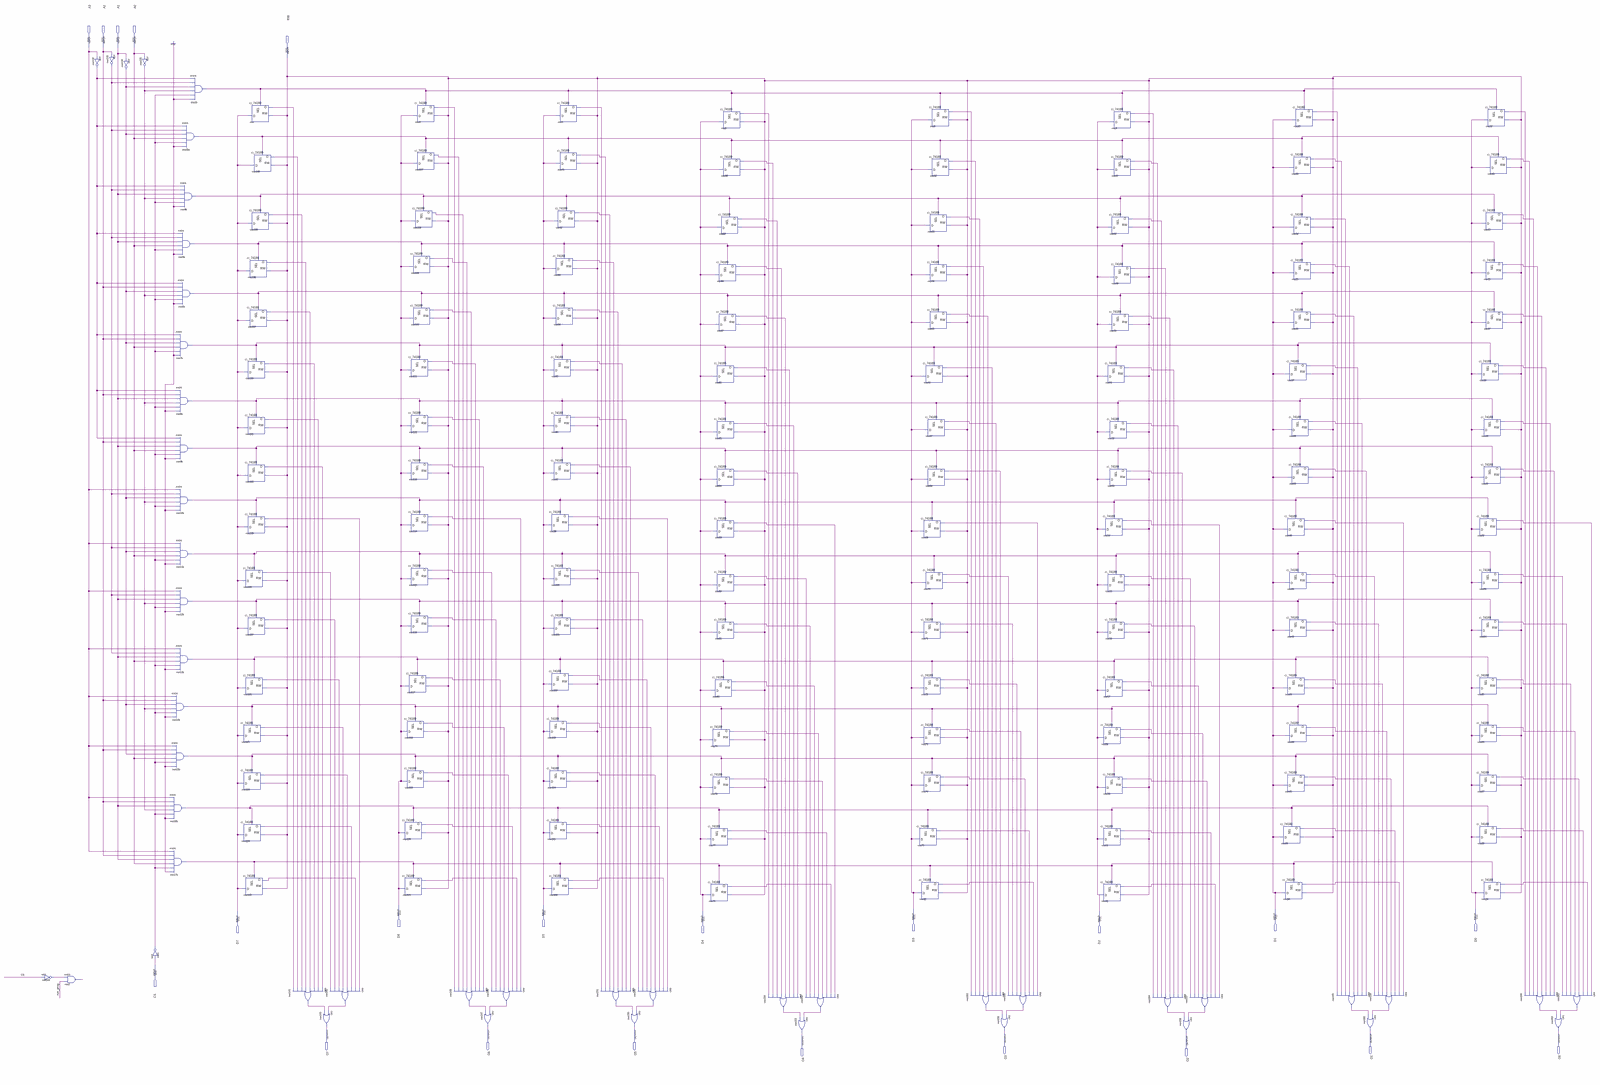
[diagram p0: schematic sheet, whole]
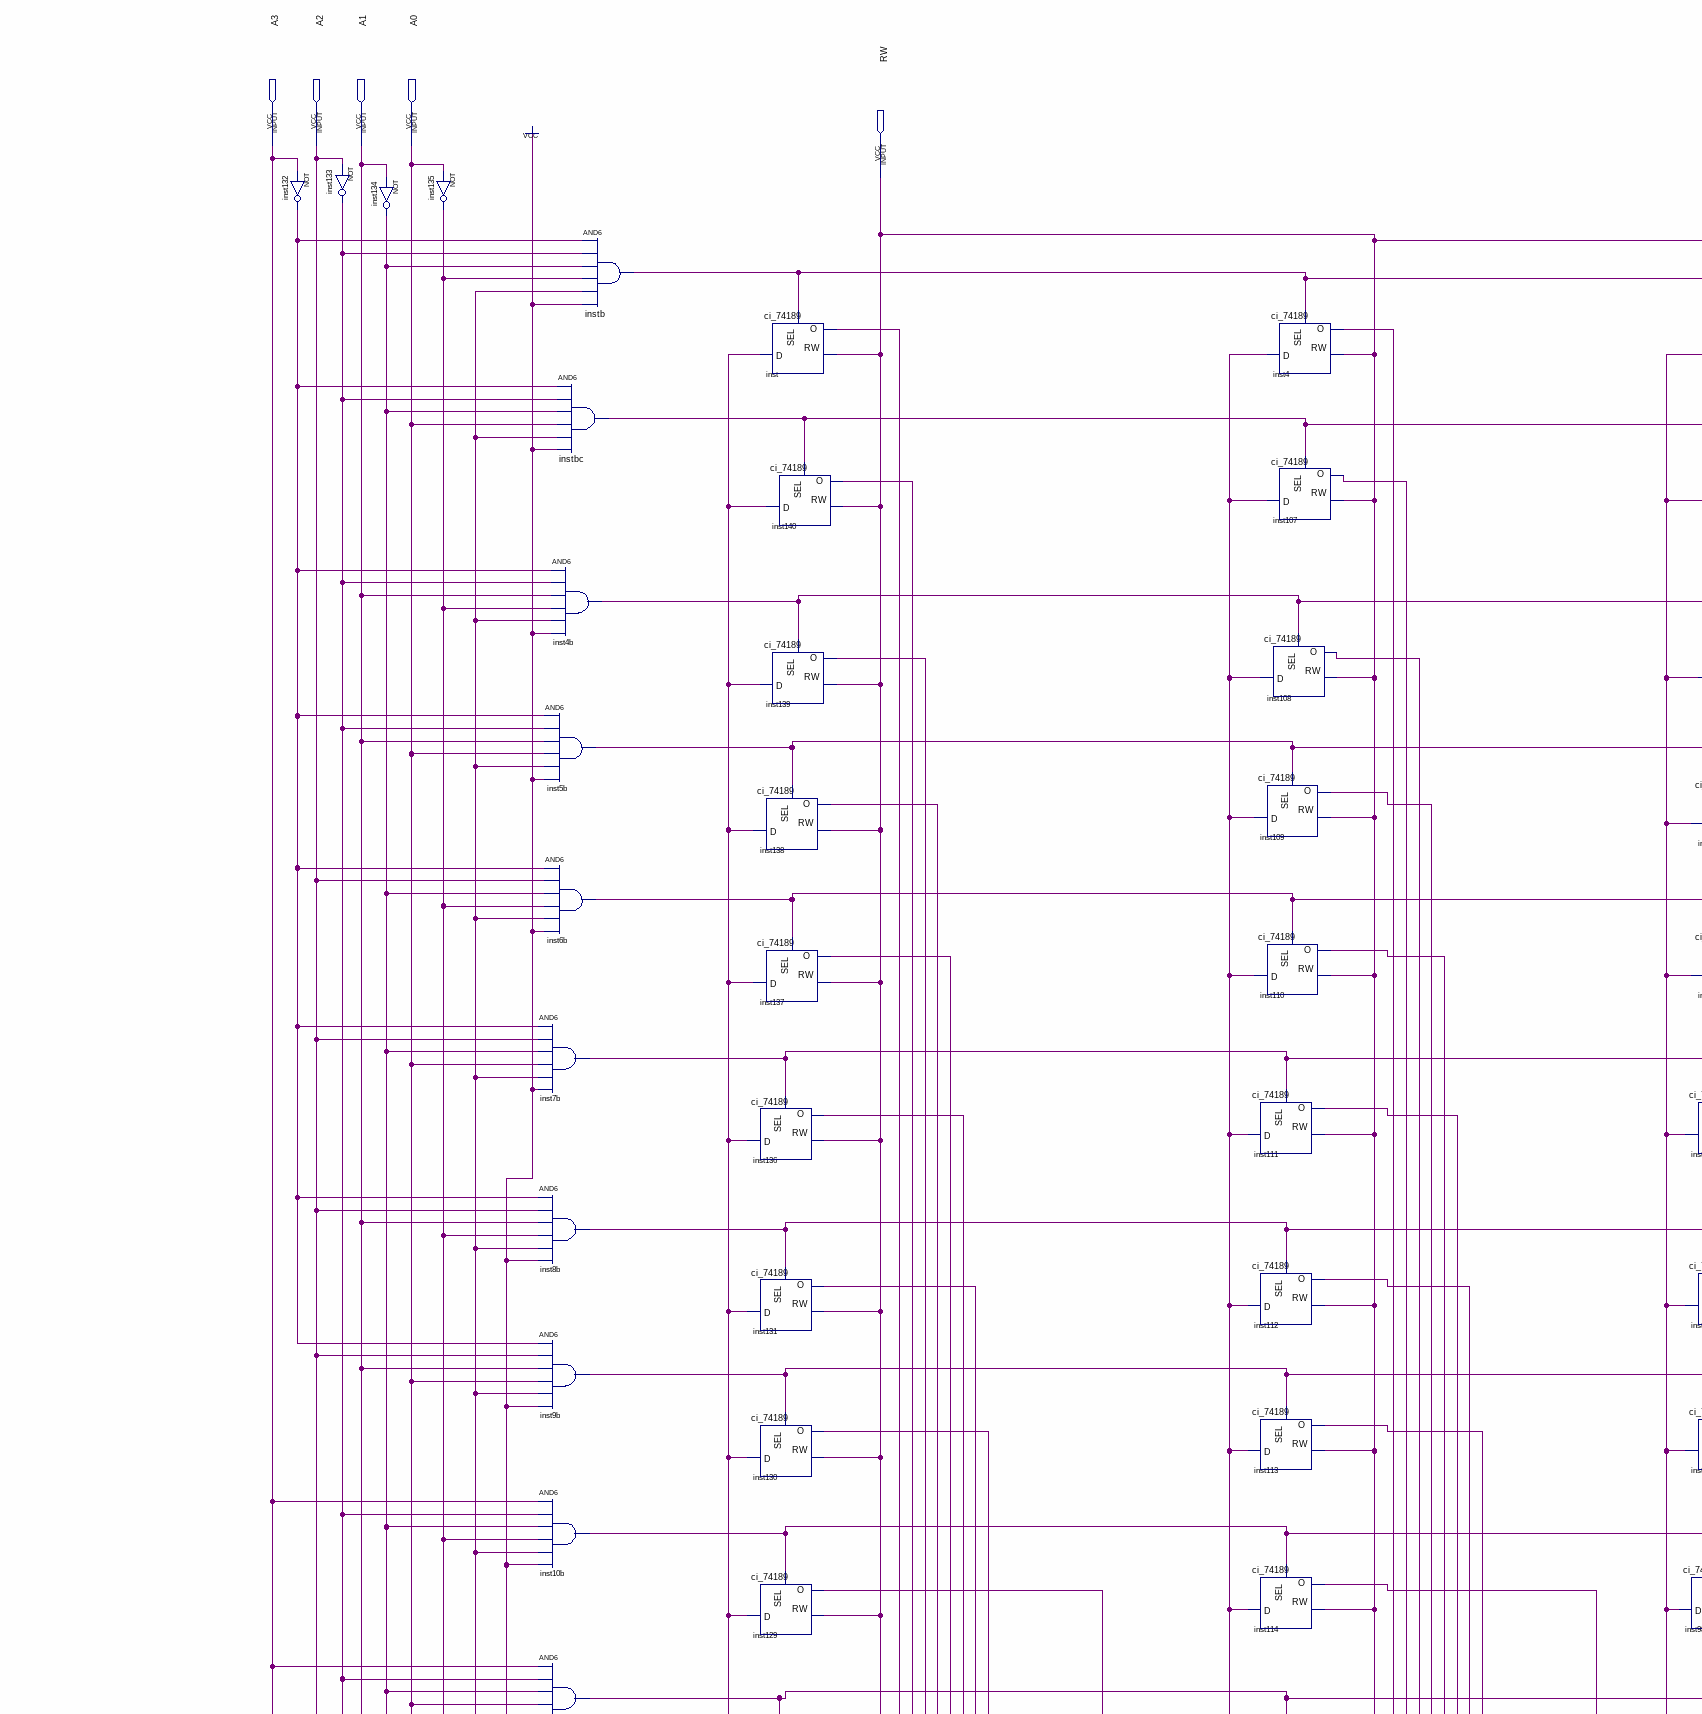
[diagram p1: schematic sheet, upper left part]
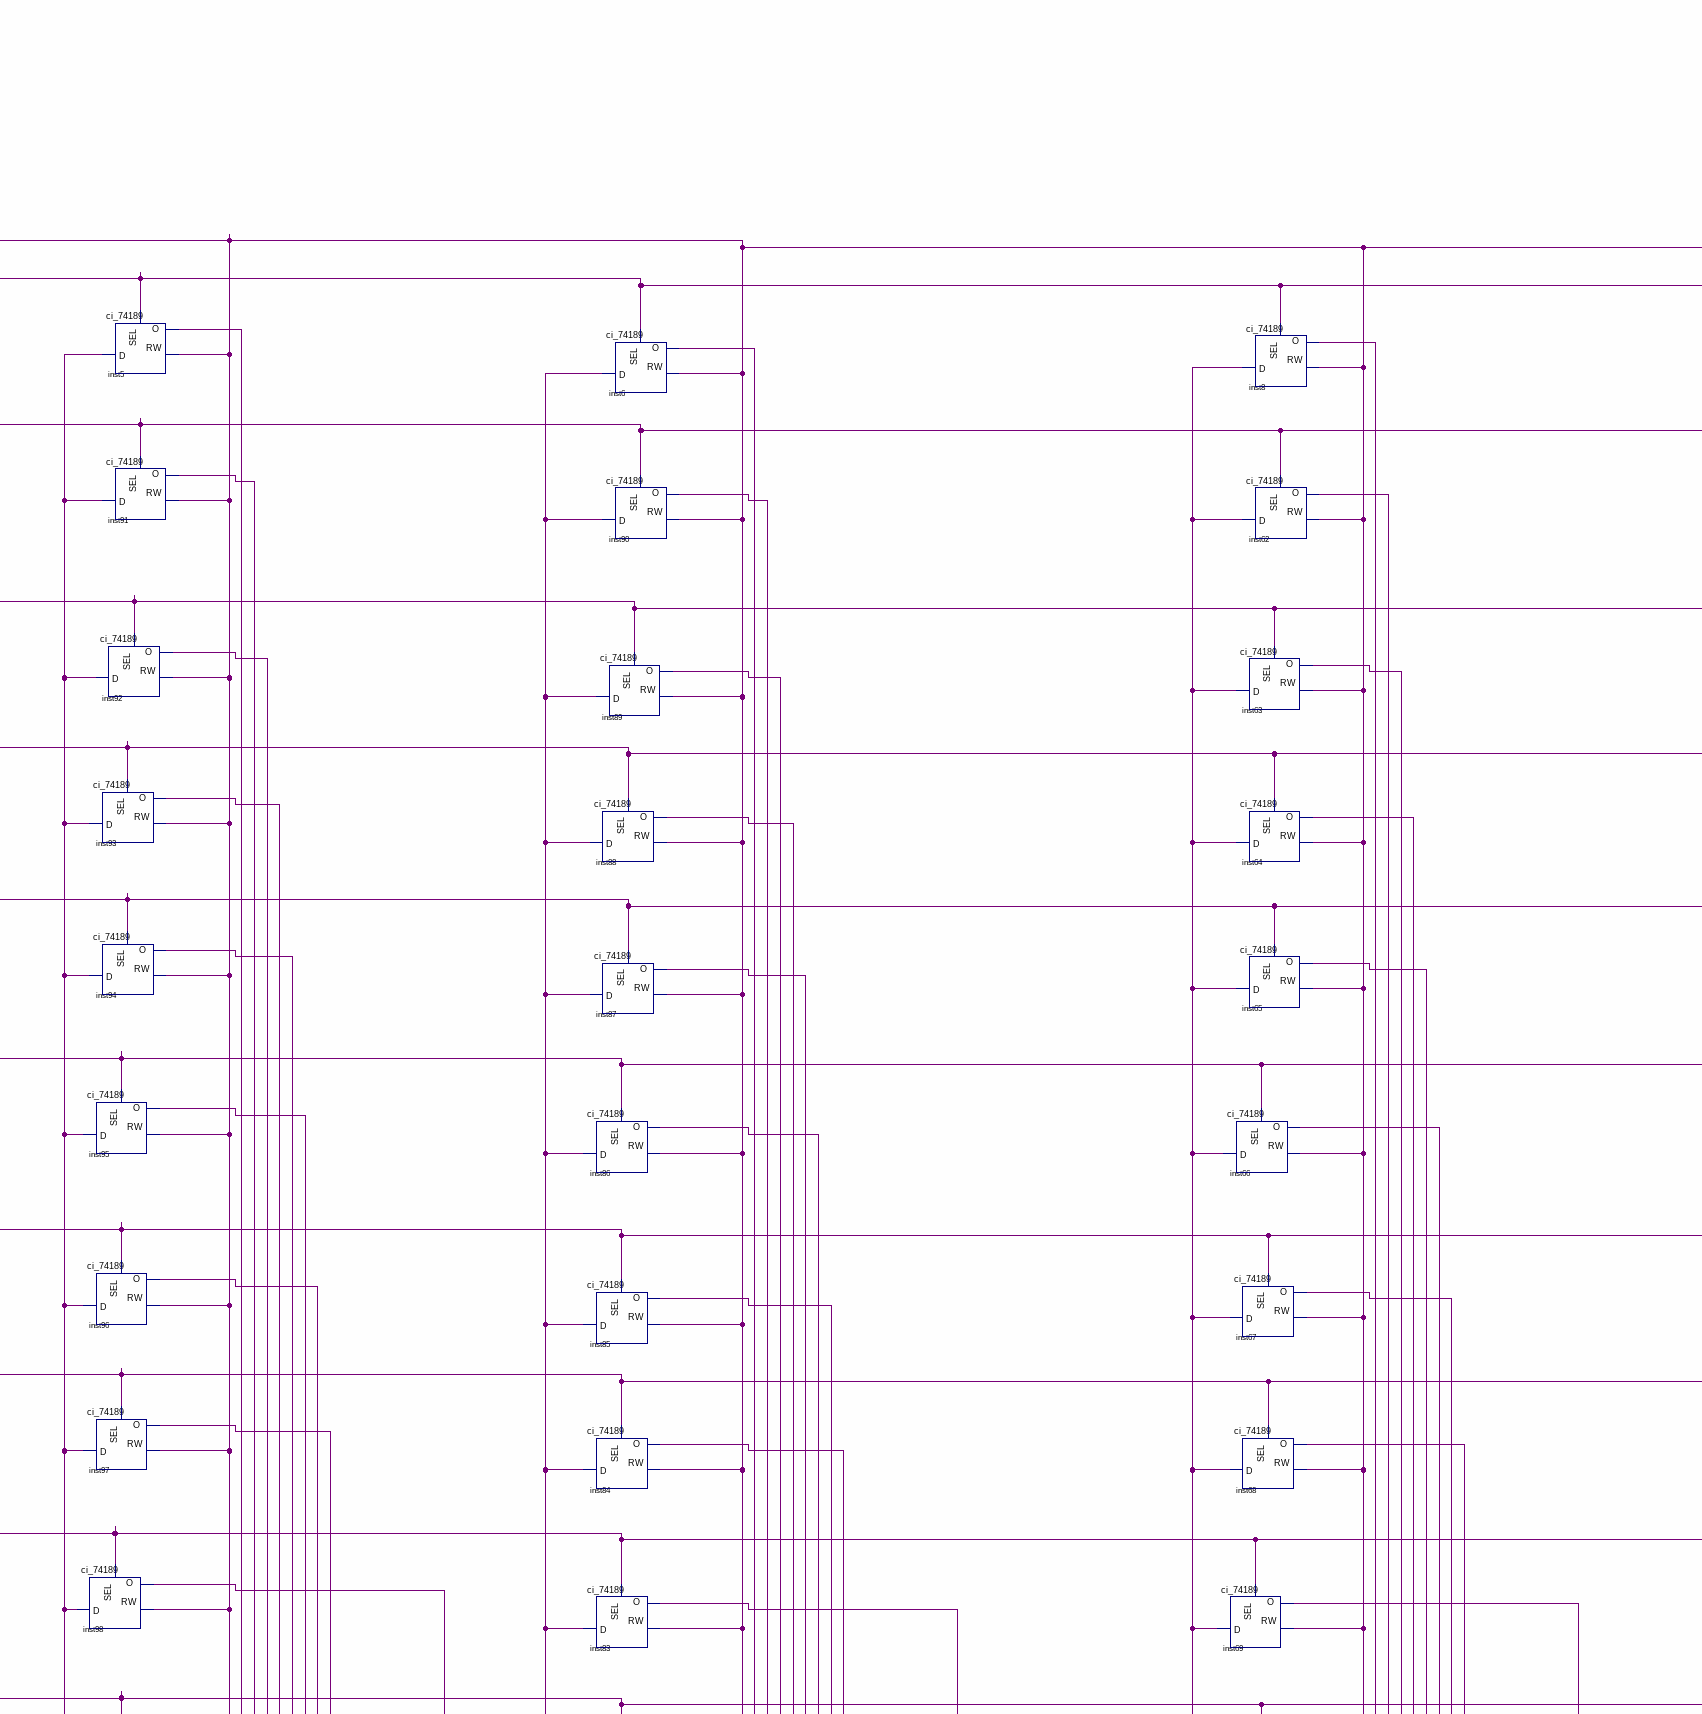
[diagram p2: schematic sheet, upper centre part]
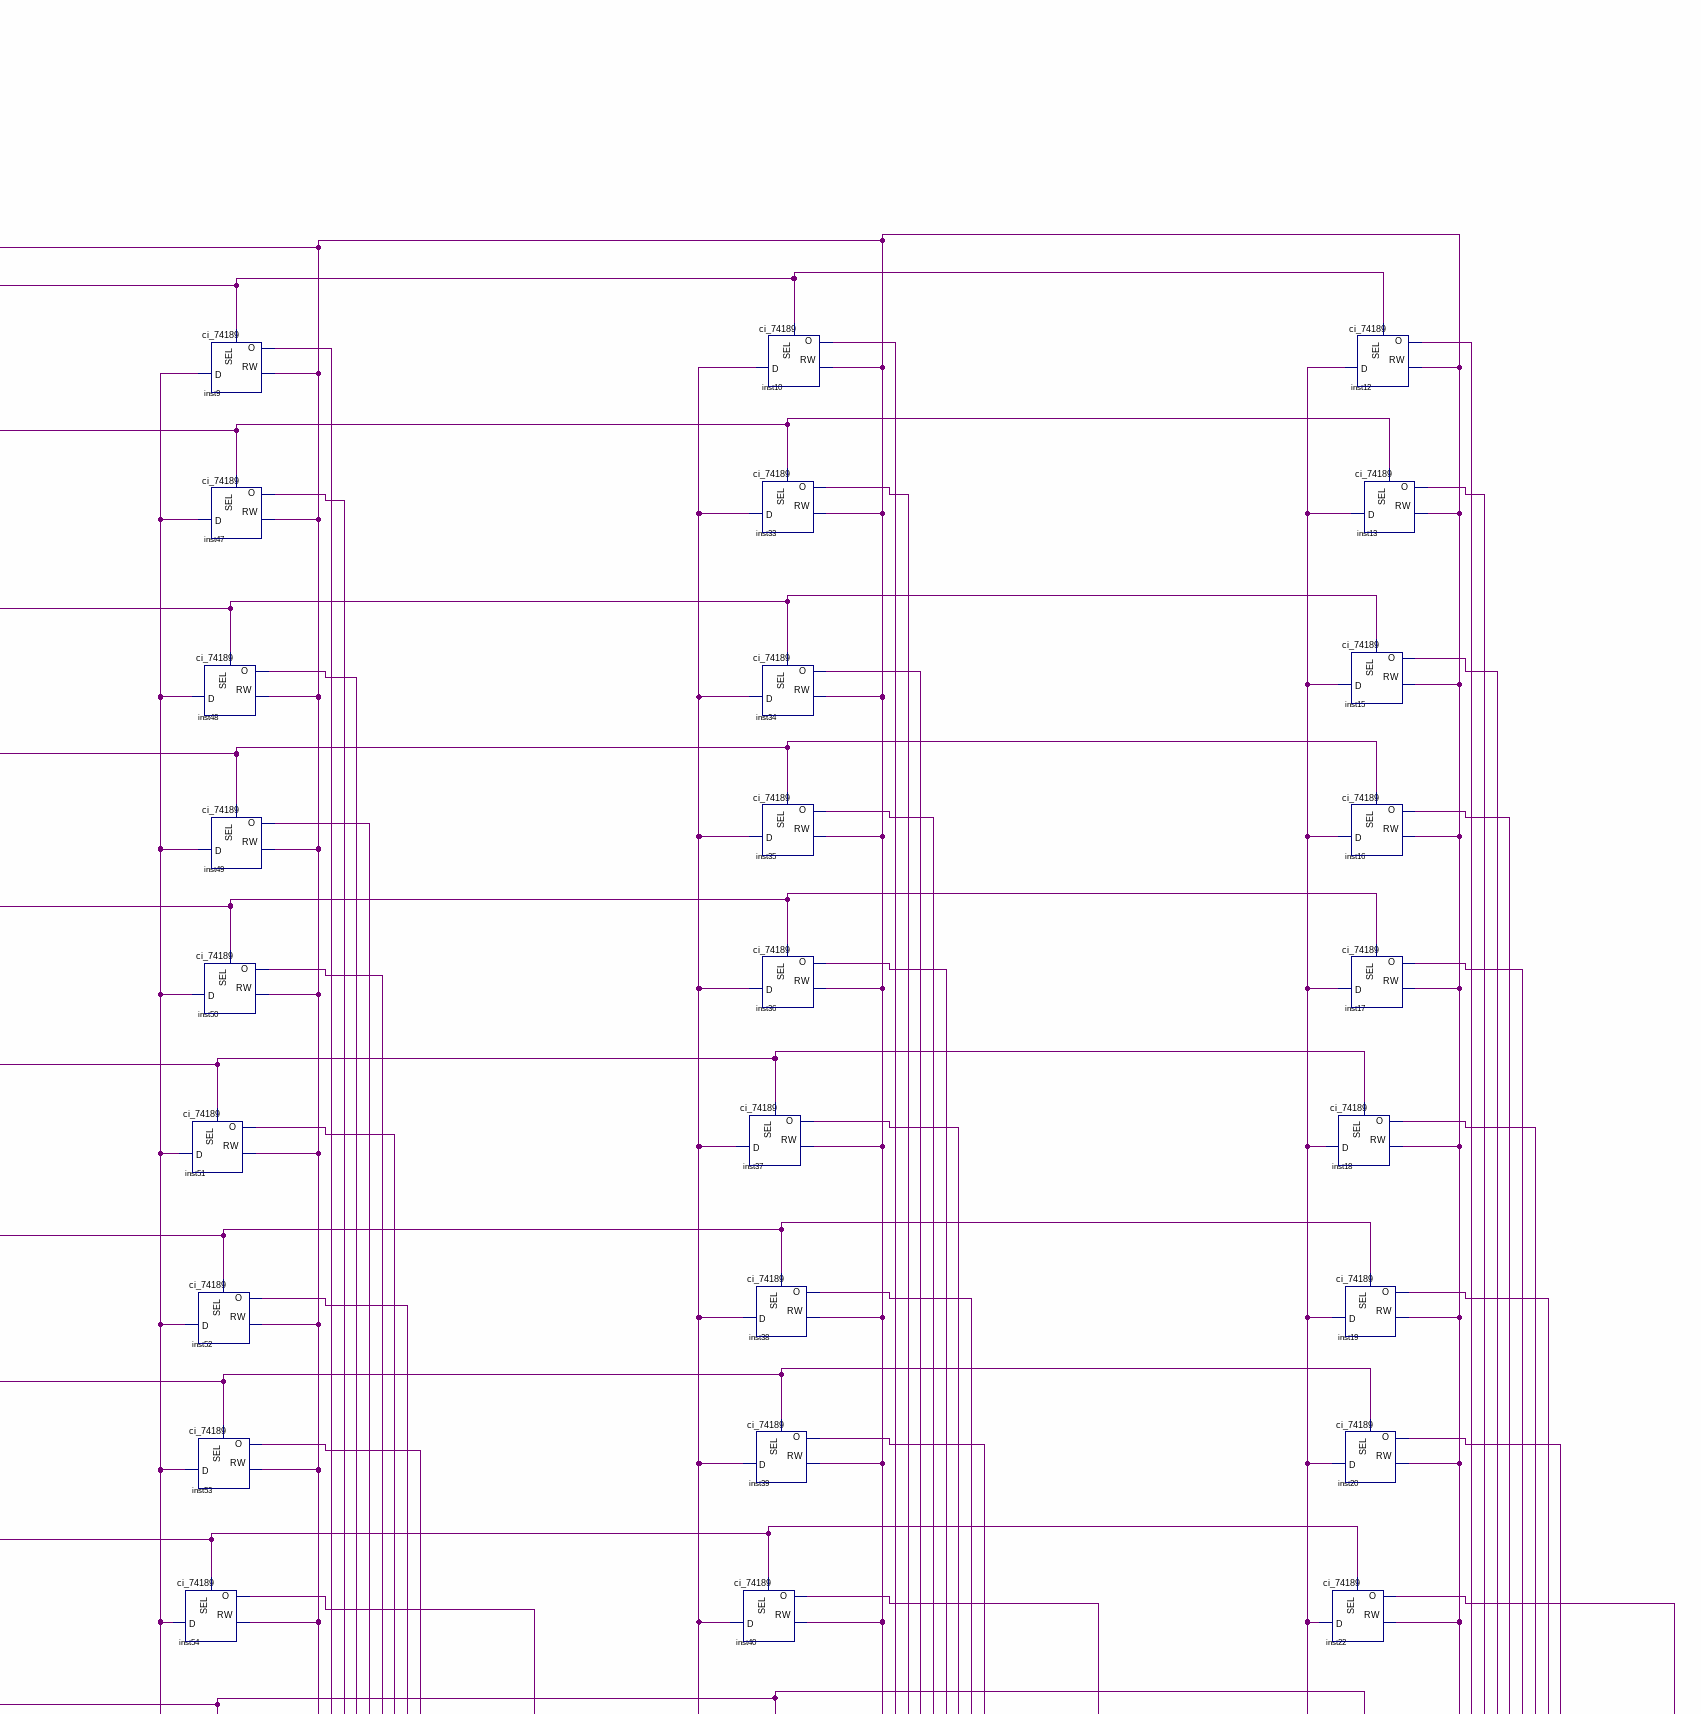
[diagram p3: schematic sheet, upper right part]
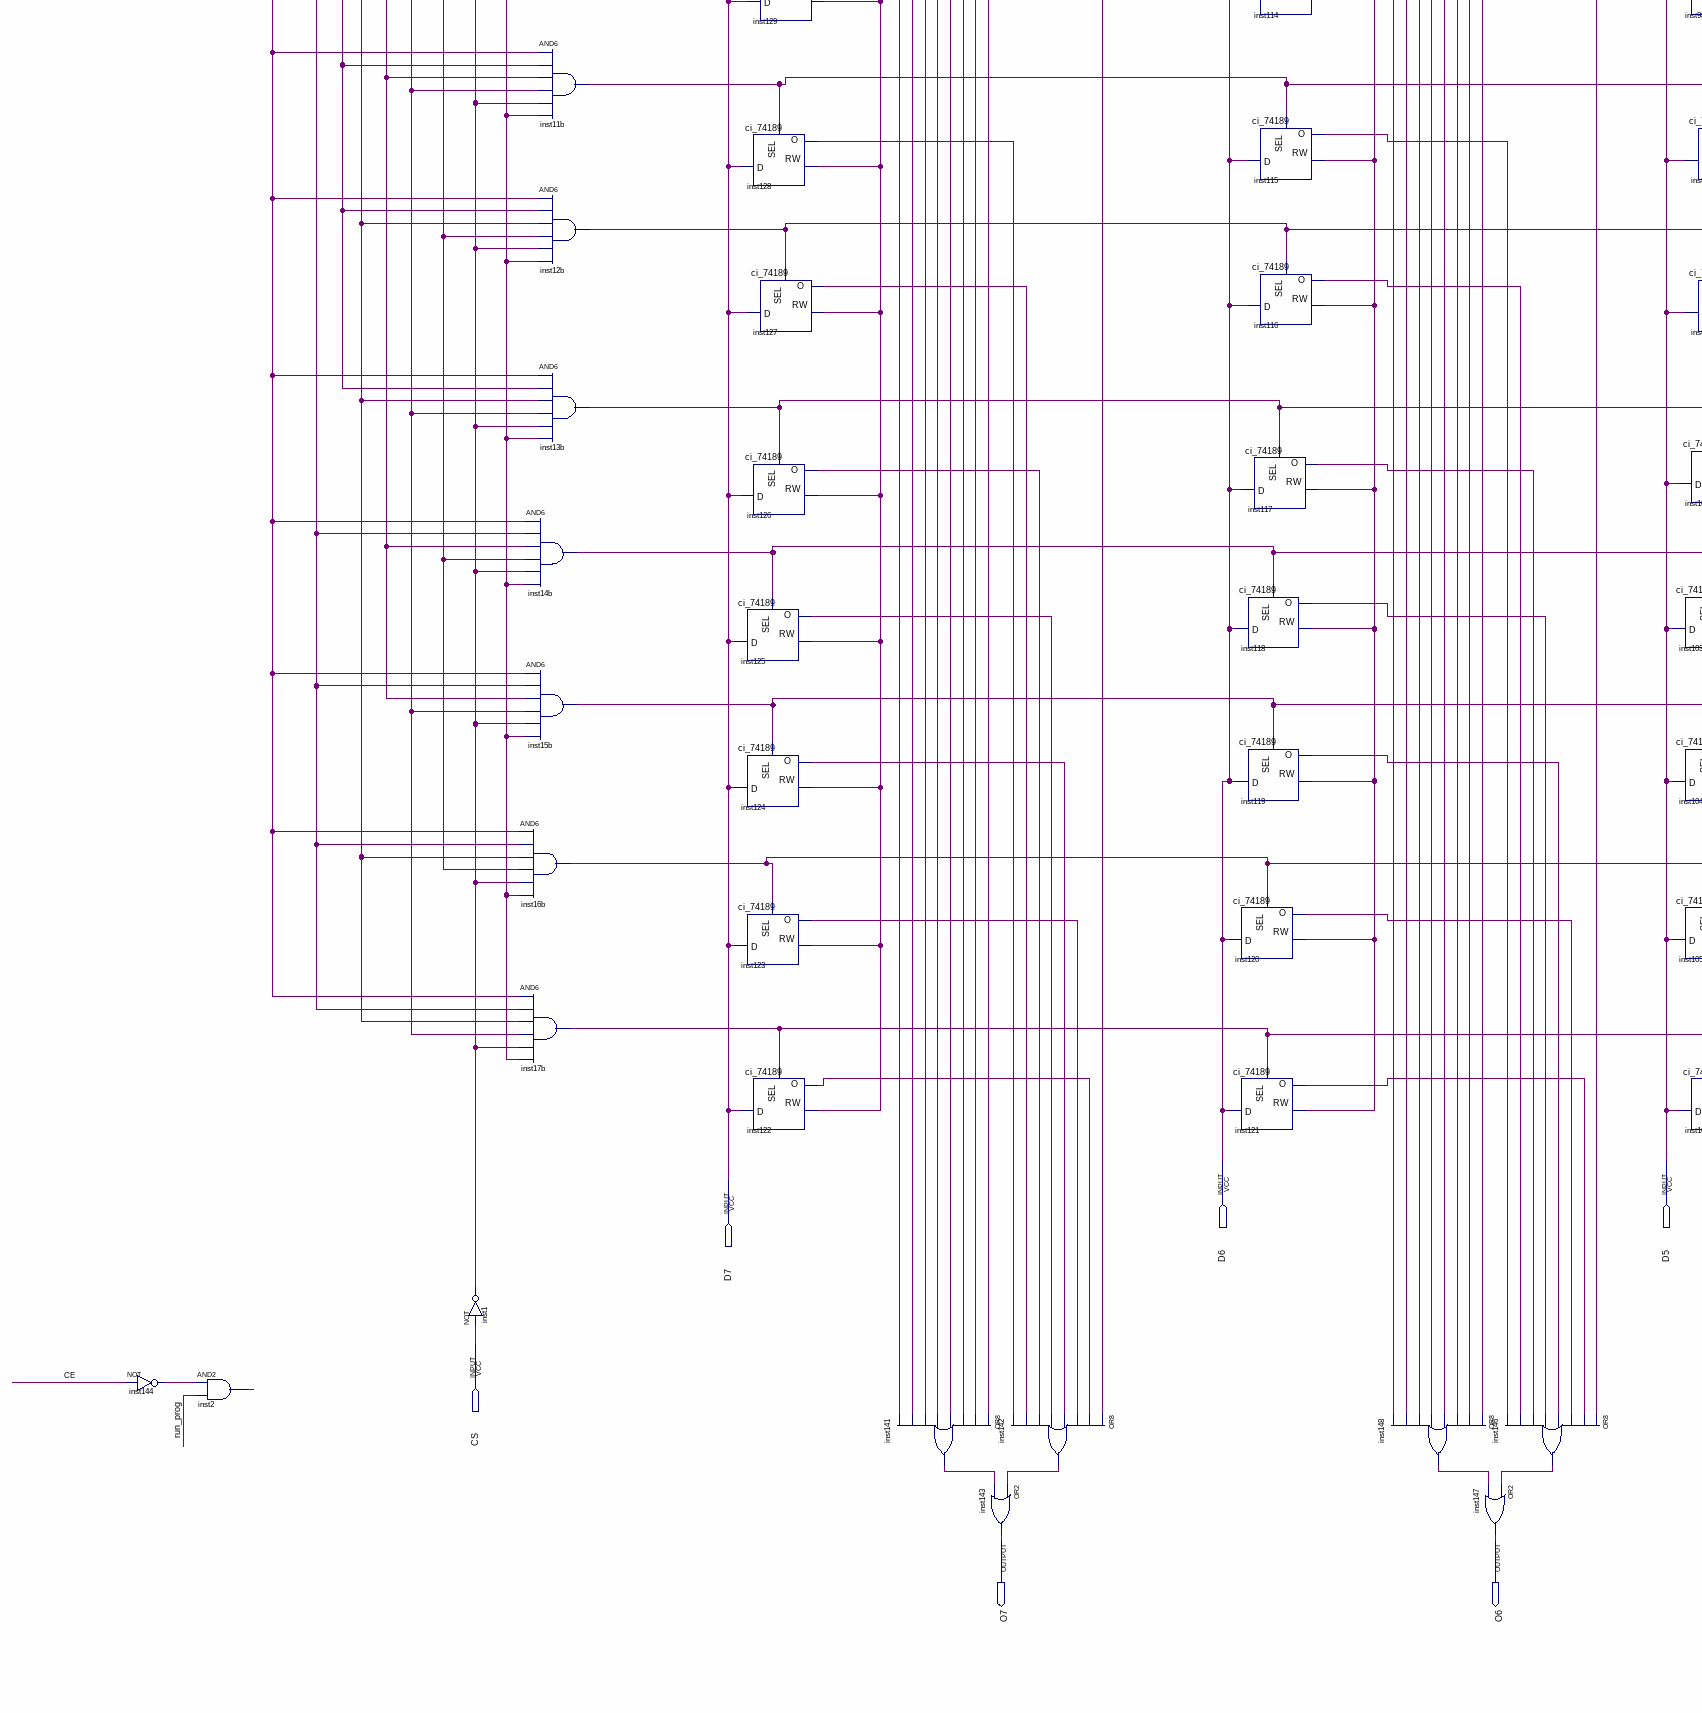
[diagram p4: schematic sheet, lower left part]
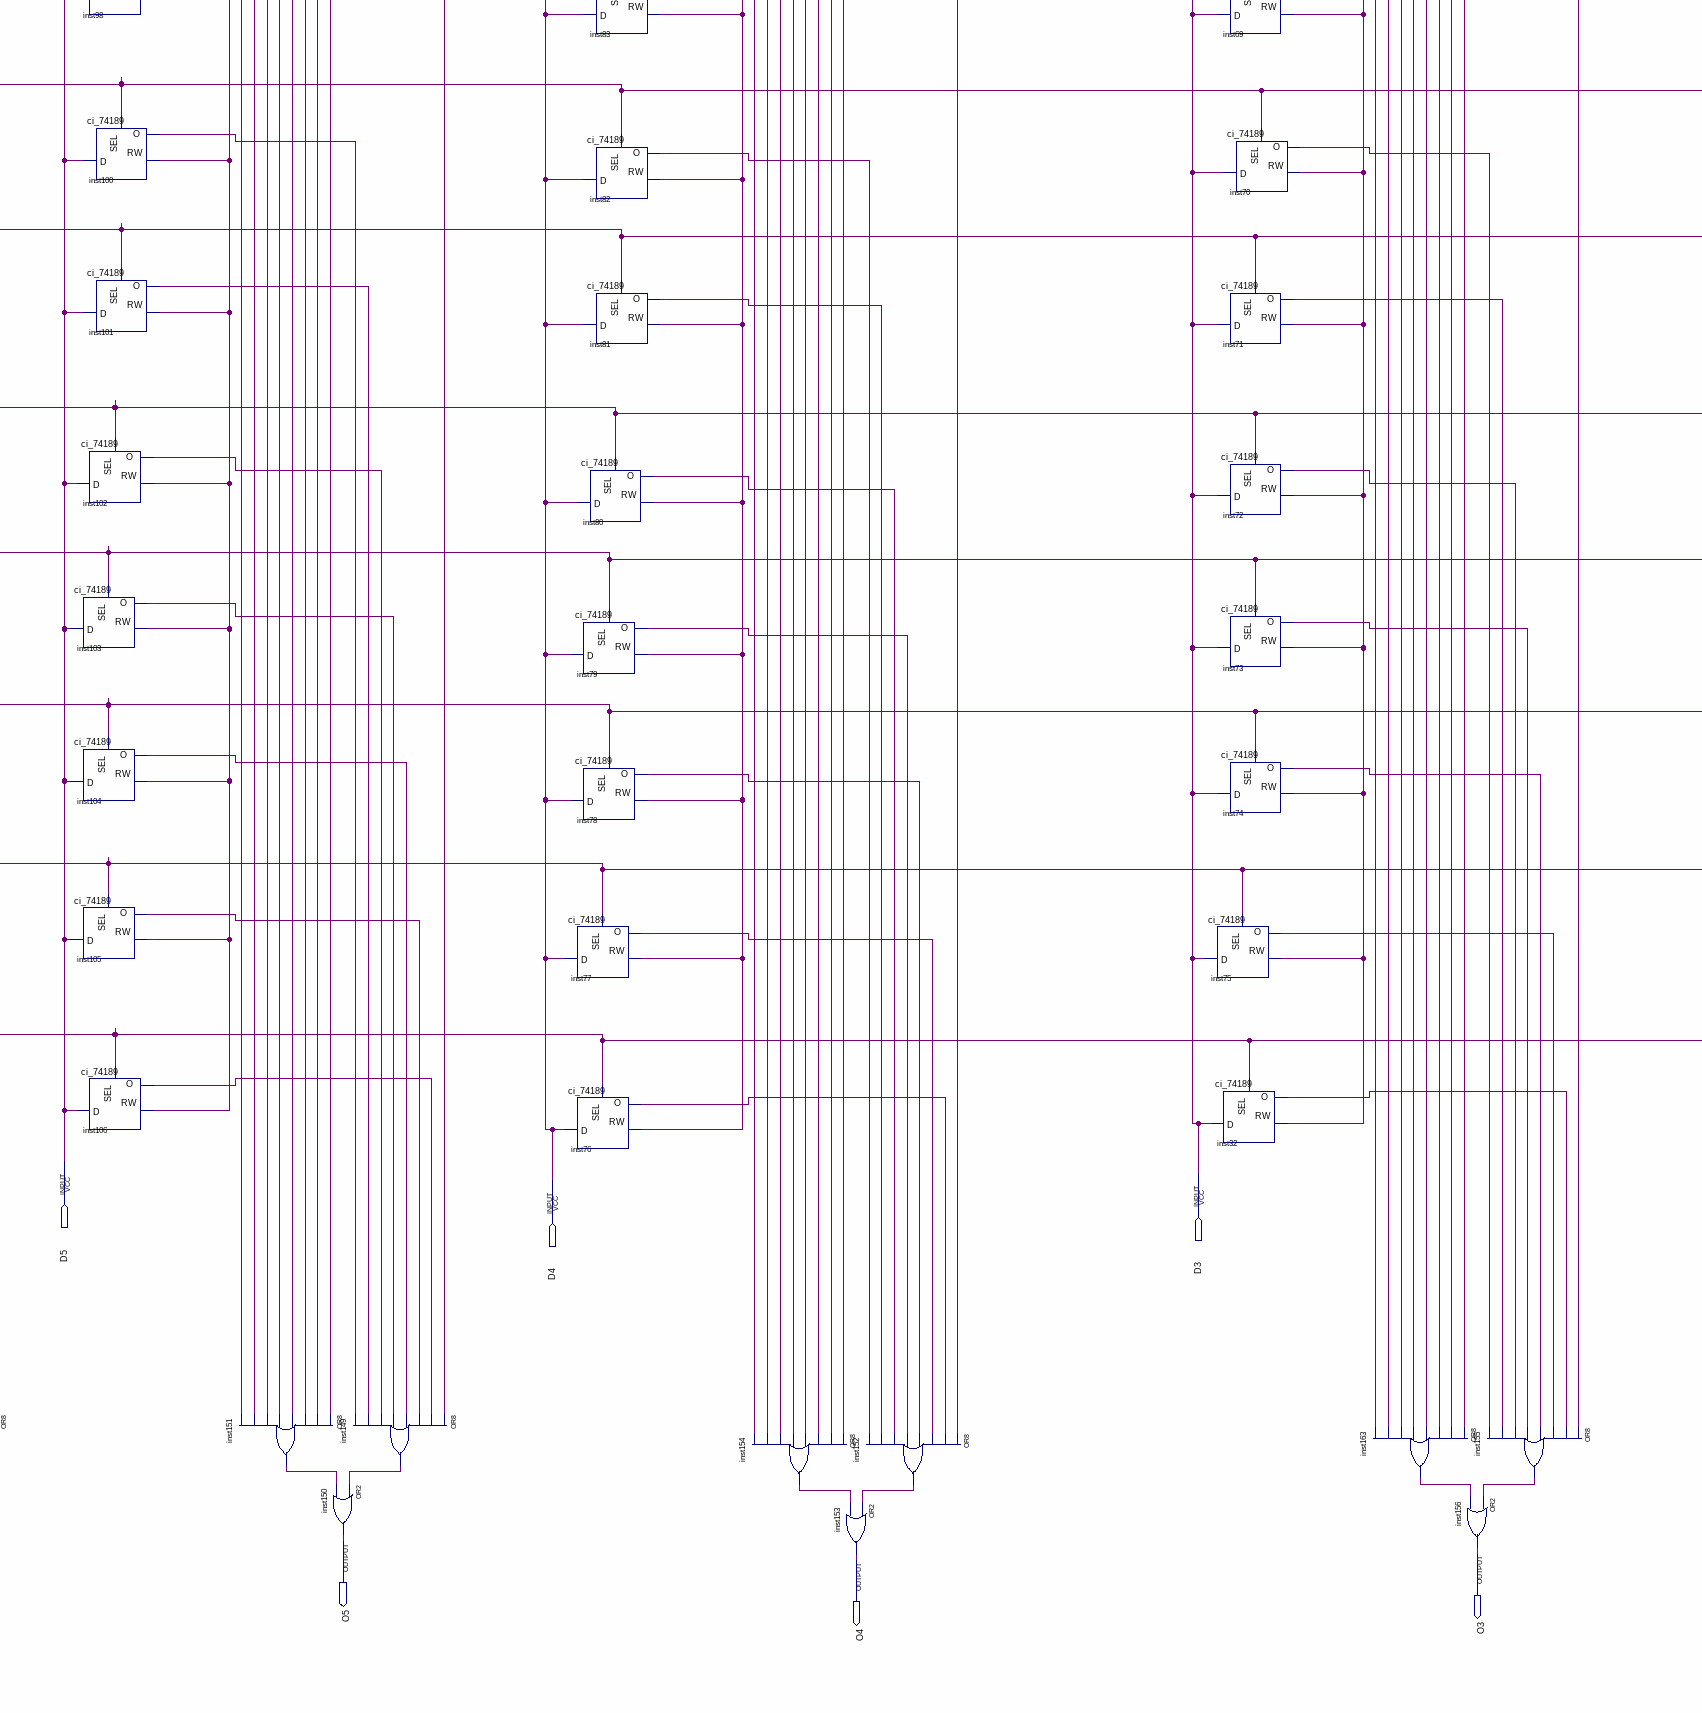
[diagram p5: schematic sheet, lower centre part]
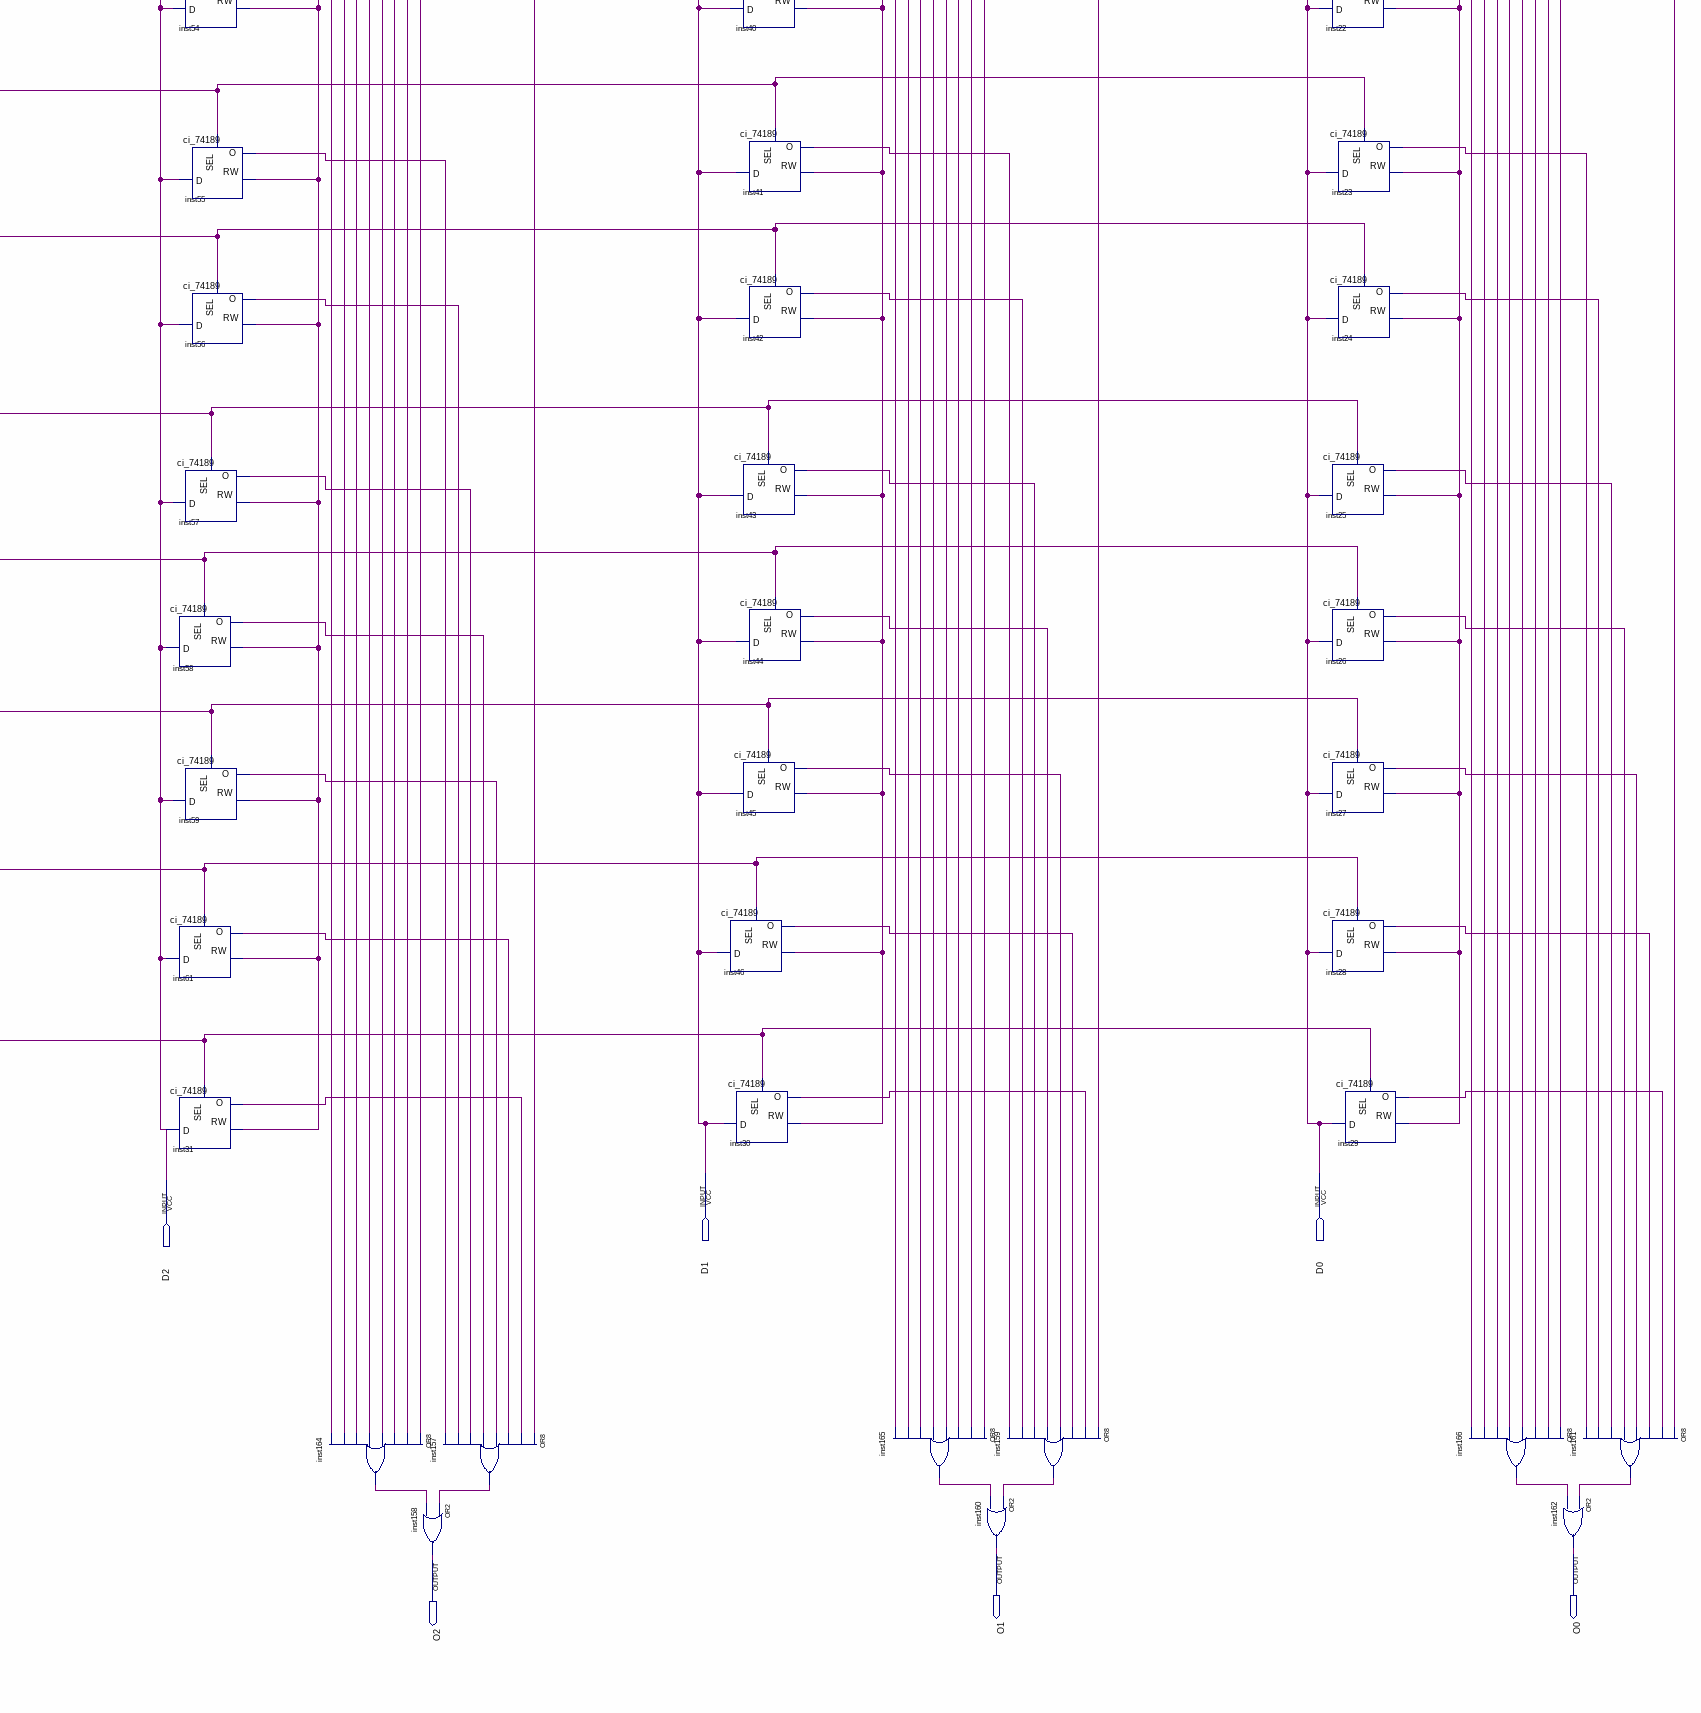
[diagram p6: schematic sheet, lower right part]
// Quartus schematic ram16x8.bdf as structural Verilog: 175 symbols, 22 pins
module ram16x8 (
  input  A3,
  input  A2,
  input  A1,
  input  A0,
  input  RW,
  input  D6,
  input  D5,
  input  D3,
  input  D1,
  input  D0,
  input  D7,
  input  D4,
  input  D2,
  input  CS,
  output O7,
  output O6,
  output O5,
  output O3,
  output O1,
  output O0,
  output O4,
  output O2
);

  wire CE, inst1_out, inst2_out, inst4_o, inst4b_out, inst5_o, inst5b_out, inst6_o, inst6b_out, inst7b_out,
       inst8_o, inst8b_out, inst9_o, inst9b_out, inst10_o, inst10b_out, inst11b_out, inst12_o, inst12b_out,
       inst13_o, inst13b_out, inst14b_out, inst15_o, inst15b_out, inst16_o, inst16b_out, inst17_o,
       inst17b_out, inst18_o, inst19_o, inst20_o, inst22_o, inst23_o, inst24_o, inst25_o, inst26_o, inst27_o,
       inst28_o, inst29_o, inst30_o, inst31_o, inst32_o, inst33_o, inst34_o, inst35_o, inst36_o, inst37_o,
       inst38_o, inst39_o, inst40_o, inst41_o, inst42_o, inst43_o, inst44_o, inst45_o, inst46_o, inst47_o,
       inst48_o, inst49_o, inst50_o, inst51_o, inst52_o, inst53_o, inst54_o, inst55_o, inst56_o, inst57_o,
       inst58_o, inst59_o, inst61_o, inst62_o, inst63_o, inst64_o, inst65_o, inst66_o, inst67_o, inst68_o,
       inst69_o, inst70_o, inst71_o, inst72_o, inst73_o, inst74_o, inst75_o, inst76_o, inst77_o, inst78_o,
       inst79_o, inst80_o, inst81_o, inst82_o, inst83_o, inst84_o, inst85_o, inst86_o, inst87_o, inst88_o,
       inst89_o, inst90_o, inst91_o, inst92_o, inst93_o, inst94_o, inst95_o, inst96_o, inst97_o, inst98_o,
       inst100_o, inst101_o, inst102_o, inst103_o, inst104_o, inst105_o, inst106_o, inst107_o, inst108_o,
       inst109_o, inst110_o, inst111_o, inst112_o, inst113_o, inst114_o, inst115_o, inst116_o, inst117_o,
       inst118_o, inst119_o, inst120_o, inst121_o, inst122_o, inst123_o, inst124_o, inst125_o, inst126_o,
       inst127_o, inst128_o, inst129_o, inst130_o, inst131_o, inst132_out, inst133_out, inst134_out,
       inst135_out, inst136_o, inst137_o, inst138_o, inst139_o, inst140_o, inst141_out, inst142_out,
       inst144_out, inst146_out, inst148_out, inst149_out, inst151_out, inst152_out, inst154_out,
       inst155_out, inst157_out, inst159_out, inst161_out, inst163_out, inst164_out, inst165_out,
       inst166_out, inst_o, instb_out, instbc_out, run_prog;

  not inst144 (inst144_out, CE);
  and inst2 (inst2_out, inst144_out, run_prog);
  not inst132 (inst132_out, A3);
  not inst133 (inst133_out, A2);
  not inst134 (inst134_out, A1);
  not inst135 (inst135_out, A0);
  not inst1 (inst1_out, CS);
  and inst14b (inst14b_out, A3, A2, inst134_out, inst135_out, inst1_out, 1'b1);
  and inst15b (inst15b_out, A3, A2, inst134_out, A0, inst1_out, 1'b1);
  and inst16b (inst16b_out, A3, A2, A1, inst135_out, inst1_out, 1'b1);
  and inst17b (inst17b_out, A3, A2, A1, A0, inst1_out, 1'b1);
  and instbc (instbc_out, inst132_out, inst133_out, inst134_out, A0, inst1_out, 1'b1);
  and inst4b (inst4b_out, inst132_out, inst133_out, A1, inst135_out, inst1_out, 1'b1);
  and inst5b (inst5b_out, inst132_out, inst133_out, A1, A0, inst1_out, 1'b1);
  and inst6b (inst6b_out, inst132_out, A2, inst134_out, inst135_out, inst1_out, 1'b1);
  and inst7b (inst7b_out, inst132_out, A2, inst134_out, A0, inst1_out, 1'b1);
  and inst8b (inst8b_out, inst132_out, A2, A1, inst135_out, inst1_out, 1'b1);
  and inst9b (inst9b_out, inst132_out, A2, A1, A0, inst1_out, 1'b1);
  and inst10b (inst10b_out, A3, inst133_out, inst134_out, inst135_out, inst1_out, 1'b1);
  and inst11b (inst11b_out, A3, inst133_out, inst134_out, A0, inst1_out, 1'b1);
  and inst12b (inst12b_out, A3, inst133_out, A1, inst135_out, inst1_out, 1'b1);
  and inst13b (inst13b_out, A3, inst133_out, A1, A0, inst1_out, 1'b1);
  and instb (instb_out, inst132_out, inst133_out, inst134_out, inst135_out, inst1_out, 1'b1);
  ci_74189 inst (.SEL(instb_out), .D(D7), .RW(RW), .O(inst_o));
  ci_74189 inst140 (.SEL(instbc_out), .D(D7), .RW(RW), .O(inst140_o));
  ci_74189 inst139 (.SEL(inst4b_out), .D(D7), .RW(RW), .O(inst139_o));
  ci_74189 inst138 (.SEL(inst5b_out), .D(D7), .RW(RW), .O(inst138_o));
  ci_74189 inst137 (.SEL(inst6b_out), .D(D7), .RW(RW), .O(inst137_o));
  ci_74189 inst136 (.SEL(inst7b_out), .D(D7), .RW(RW), .O(inst136_o));
  ci_74189 inst131 (.SEL(inst8b_out), .D(D7), .RW(RW), .O(inst131_o));
  ci_74189 inst130 (.SEL(inst9b_out), .D(D7), .RW(RW), .O(inst130_o));
  ci_74189 inst129 (.SEL(inst10b_out), .D(D7), .RW(RW), .O(inst129_o));
  ci_74189 inst128 (.SEL(inst11b_out), .D(D7), .RW(RW), .O(inst128_o));
  ci_74189 inst127 (.SEL(inst12b_out), .D(D7), .RW(RW), .O(inst127_o));
  ci_74189 inst126 (.SEL(inst13b_out), .D(D7), .RW(RW), .O(inst126_o));
  ci_74189 inst125 (.SEL(inst14b_out), .D(D7), .RW(RW), .O(inst125_o));
  ci_74189 inst124 (.SEL(inst15b_out), .D(D7), .RW(RW), .O(inst124_o));
  ci_74189 inst123 (.SEL(inst16b_out), .D(D7), .RW(RW), .O(inst123_o));
  ci_74189 inst122 (.SEL(inst17b_out), .D(D7), .RW(RW), .O(inst122_o));
  or inst141 (inst141_out, inst130_o, inst131_o, inst136_o, inst137_o, inst138_o, inst139_o, inst140_o, inst_o);
  or inst143 (O7, inst142_out, inst141_out);
  or inst142 (inst142_out, inst129_o, inst122_o, inst123_o, inst124_o, inst125_o, inst126_o, inst127_o, inst128_o);
  ci_74189 inst118 (.SEL(inst14b_out), .D(D6), .RW(RW), .O(inst118_o));
  ci_74189 inst119 (.SEL(inst15b_out), .D(D6), .RW(RW), .O(inst119_o));
  ci_74189 inst120 (.SEL(inst16b_out), .D(D6), .RW(RW), .O(inst120_o));
  ci_74189 inst121 (.SEL(inst17b_out), .D(D6), .RW(RW), .O(inst121_o));
  ci_74189 inst4 (.SEL(instb_out), .D(D6), .RW(RW), .O(inst4_o));
  ci_74189 inst107 (.SEL(instbc_out), .D(D6), .RW(RW), .O(inst107_o));
  ci_74189 inst108 (.SEL(inst4b_out), .D(D6), .RW(RW), .O(inst108_o));
  ci_74189 inst109 (.SEL(inst5b_out), .D(D6), .RW(RW), .O(inst109_o));
  ci_74189 inst110 (.SEL(inst6b_out), .D(D6), .RW(RW), .O(inst110_o));
  ci_74189 inst111 (.SEL(inst7b_out), .D(D6), .RW(RW), .O(inst111_o));
  ci_74189 inst112 (.SEL(inst8b_out), .D(D6), .RW(RW), .O(inst112_o));
  ci_74189 inst113 (.SEL(inst9b_out), .D(D6), .RW(RW), .O(inst113_o));
  ci_74189 inst114 (.SEL(inst10b_out), .D(D6), .RW(RW), .O(inst114_o));
  ci_74189 inst115 (.SEL(inst11b_out), .D(D6), .RW(RW), .O(inst115_o));
  ci_74189 inst116 (.SEL(inst12b_out), .D(D6), .RW(RW), .O(inst116_o));
  ci_74189 inst117 (.SEL(inst13b_out), .D(D6), .RW(RW), .O(inst117_o));
  or inst148 (inst148_out, inst113_o, inst112_o, inst111_o, inst110_o, inst109_o, inst108_o, inst107_o, inst4_o);
  or inst147 (O6, inst146_out, inst148_out);
  or inst146 (inst146_out, inst114_o, inst121_o, inst120_o, inst119_o, inst118_o, inst117_o, inst116_o, inst115_o);
  ci_74189 inst93 (.SEL(inst5b_out), .D(D5), .RW(RW), .O(inst93_o));
  ci_74189 inst94 (.SEL(inst6b_out), .D(D5), .RW(RW), .O(inst94_o));
  ci_74189 inst95 (.SEL(inst7b_out), .D(D5), .RW(RW), .O(inst95_o));
  ci_74189 inst96 (.SEL(inst8b_out), .D(D5), .RW(RW), .O(inst96_o));
  ci_74189 inst97 (.SEL(inst9b_out), .D(D5), .RW(RW), .O(inst97_o));
  ci_74189 inst98 (.SEL(inst10b_out), .D(D5), .RW(RW), .O(inst98_o));
  ci_74189 inst100 (.SEL(inst11b_out), .D(D5), .RW(RW), .O(inst100_o));
  ci_74189 inst101 (.SEL(inst12b_out), .D(D5), .RW(RW), .O(inst101_o));
  ci_74189 inst102 (.SEL(inst13b_out), .D(D5), .RW(RW), .O(inst102_o));
  ci_74189 inst103 (.SEL(inst14b_out), .D(D5), .RW(RW), .O(inst103_o));
  ci_74189 inst104 (.SEL(inst15b_out), .D(D5), .RW(RW), .O(inst104_o));
  ci_74189 inst105 (.SEL(inst16b_out), .D(D5), .RW(RW), .O(inst105_o));
  ci_74189 inst106 (.SEL(inst17b_out), .D(D5), .RW(RW), .O(inst106_o));
  ci_74189 inst5 (.SEL(instb_out), .D(D5), .RW(RW), .O(inst5_o));
  ci_74189 inst91 (.SEL(instbc_out), .D(D5), .RW(RW), .O(inst91_o));
  ci_74189 inst92 (.SEL(inst4b_out), .D(D5), .RW(RW), .O(inst92_o));
  or inst151 (inst151_out, inst97_o, inst96_o, inst95_o, inst94_o, inst93_o, inst92_o, inst91_o, inst5_o);
  or inst149 (inst149_out, inst98_o, inst106_o, inst105_o, inst104_o, inst103_o, inst102_o, inst101_o, inst100_o);
  or inst150 (O5, inst149_out, inst151_out);
  ci_74189 inst89 (.SEL(inst4b_out), .D(D4), .RW(RW), .O(inst89_o));
  ci_74189 inst88 (.SEL(inst5b_out), .D(D4), .RW(RW), .O(inst88_o));
  ci_74189 inst87 (.SEL(inst6b_out), .D(D4), .RW(RW), .O(inst87_o));
  ci_74189 inst86 (.SEL(inst7b_out), .D(D4), .RW(RW), .O(inst86_o));
  ci_74189 inst85 (.SEL(inst8b_out), .D(D4), .RW(RW), .O(inst85_o));
  ci_74189 inst84 (.SEL(inst9b_out), .D(D4), .RW(RW), .O(inst84_o));
  ci_74189 inst83 (.SEL(inst10b_out), .D(D4), .RW(RW), .O(inst83_o));
  ci_74189 inst82 (.SEL(inst11b_out), .D(D4), .RW(RW), .O(inst82_o));
  ci_74189 inst81 (.SEL(inst12b_out), .D(D4), .RW(RW), .O(inst81_o));
  ci_74189 inst80 (.SEL(inst13b_out), .D(D4), .RW(RW), .O(inst80_o));
  ci_74189 inst79 (.SEL(inst14b_out), .D(D4), .RW(RW), .O(inst79_o));
  ci_74189 inst78 (.SEL(inst15b_out), .D(D4), .RW(RW), .O(inst78_o));
  ci_74189 inst77 (.SEL(inst16b_out), .D(D4), .RW(RW), .O(inst77_o));
  ci_74189 inst76 (.SEL(inst17b_out), .D(D4), .RW(RW), .O(inst76_o));
  ci_74189 inst6 (.SEL(instb_out), .D(D4), .RW(RW), .O(inst6_o));
  ci_74189 inst90 (.SEL(instbc_out), .D(D4), .RW(RW), .O(inst90_o));
  or inst154 (inst154_out, inst84_o, inst85_o, inst86_o, inst87_o, inst88_o, inst89_o, inst90_o, inst6_o);
  or inst153 (O4, inst152_out, inst154_out);
  or inst152 (inst152_out, inst83_o, inst76_o, inst77_o, inst78_o, inst79_o, inst80_o, inst81_o, inst82_o);
  ci_74189 inst75 (.SEL(inst16b_out), .D(D3), .RW(RW), .O(inst75_o));
  ci_74189 inst8 (.SEL(instb_out), .D(D3), .RW(RW), .O(inst8_o));
  ci_74189 inst62 (.SEL(instbc_out), .D(D3), .RW(RW), .O(inst62_o));
  ci_74189 inst63 (.SEL(inst4b_out), .D(D3), .RW(RW), .O(inst63_o));
  ci_74189 inst64 (.SEL(inst5b_out), .D(D3), .RW(RW), .O(inst64_o));
  ci_74189 inst65 (.SEL(inst6b_out), .D(D3), .RW(RW), .O(inst65_o));
  ci_74189 inst66 (.SEL(inst7b_out), .D(D3), .RW(RW), .O(inst66_o));
  ci_74189 inst67 (.SEL(inst8b_out), .D(D3), .RW(RW), .O(inst67_o));
  ci_74189 inst68 (.SEL(inst9b_out), .D(D3), .RW(RW), .O(inst68_o));
  ci_74189 inst69 (.SEL(inst10b_out), .D(D3), .RW(RW), .O(inst69_o));
  ci_74189 inst70 (.SEL(inst11b_out), .D(D3), .RW(RW), .O(inst70_o));
  ci_74189 inst71 (.SEL(inst12b_out), .D(D3), .RW(RW), .O(inst71_o));
  ci_74189 inst72 (.SEL(inst13b_out), .D(D3), .RW(RW), .O(inst72_o));
  ci_74189 inst73 (.SEL(inst14b_out), .D(D3), .RW(RW), .O(inst73_o));
  ci_74189 inst74 (.SEL(inst15b_out), .D(D3), .RW(RW), .O(inst74_o));
  ci_74189 inst32 (.SEL(inst17b_out), .D(D3), .RW(RW), .O(inst32_o));
  or inst163 (inst163_out, inst68_o, inst67_o, inst66_o, inst65_o, inst64_o, inst63_o, inst62_o, inst8_o);
  or inst156 (O3, inst155_out, inst163_out);
  or inst155 (inst155_out, inst69_o, inst32_o, inst75_o, inst74_o, inst73_o, inst72_o, inst71_o, inst70_o);
  ci_74189 inst9 (.SEL(instb_out), .D(D2), .RW(RW), .O(inst9_o));
  ci_74189 inst47 (.SEL(instbc_out), .D(D2), .RW(RW), .O(inst47_o));
  ci_74189 inst48 (.SEL(inst4b_out), .D(D2), .RW(RW), .O(inst48_o));
  ci_74189 inst49 (.SEL(inst5b_out), .D(D2), .RW(RW), .O(inst49_o));
  ci_74189 inst50 (.SEL(inst6b_out), .D(D2), .RW(RW), .O(inst50_o));
  ci_74189 inst51 (.SEL(inst7b_out), .D(D2), .RW(RW), .O(inst51_o));
  ci_74189 inst52 (.SEL(inst8b_out), .D(D2), .RW(RW), .O(inst52_o));
  ci_74189 inst53 (.SEL(inst9b_out), .D(D2), .RW(RW), .O(inst53_o));
  ci_74189 inst54 (.SEL(inst10b_out), .D(D2), .RW(RW), .O(inst54_o));
  ci_74189 inst55 (.SEL(inst11b_out), .D(D2), .RW(RW), .O(inst55_o));
  ci_74189 inst56 (.SEL(inst12b_out), .D(D2), .RW(RW), .O(inst56_o));
  ci_74189 inst57 (.SEL(inst13b_out), .D(D2), .RW(RW), .O(inst57_o));
  ci_74189 inst58 (.SEL(inst14b_out), .D(D2), .RW(RW), .O(inst58_o));
  ci_74189 inst59 (.SEL(inst15b_out), .D(D2), .RW(RW), .O(inst59_o));
  ci_74189 inst61 (.SEL(inst16b_out), .D(D2), .RW(RW), .O(inst61_o));
  ci_74189 inst31 (.SEL(inst17b_out), .D(D2), .RW(RW), .O(inst31_o));
  or inst164 (inst164_out, inst53_o, inst52_o, inst51_o, inst50_o, inst49_o, inst48_o, inst47_o, inst9_o);
  or inst158 (O2, inst157_out, inst164_out);
  or inst157 (inst157_out, inst54_o, inst31_o, inst61_o, inst59_o, inst58_o, inst57_o, inst56_o, inst55_o);
  ci_74189 inst46 (.SEL(inst16b_out), .D(D1), .RW(RW), .O(inst46_o));
  ci_74189 inst10 (.SEL(instb_out), .D(D1), .RW(RW), .O(inst10_o));
  ci_74189 inst33 (.SEL(instbc_out), .D(D1), .RW(RW), .O(inst33_o));
  ci_74189 inst34 (.SEL(inst4b_out), .D(D1), .RW(RW), .O(inst34_o));
  ci_74189 inst35 (.SEL(inst5b_out), .D(D1), .RW(RW), .O(inst35_o));
  ci_74189 inst36 (.SEL(inst6b_out), .D(D1), .RW(RW), .O(inst36_o));
  ci_74189 inst37 (.SEL(inst7b_out), .D(D1), .RW(RW), .O(inst37_o));
  ci_74189 inst38 (.SEL(inst8b_out), .D(D1), .RW(RW), .O(inst38_o));
  ci_74189 inst39 (.SEL(inst9b_out), .D(D1), .RW(RW), .O(inst39_o));
  ci_74189 inst40 (.SEL(inst10b_out), .D(D1), .RW(RW), .O(inst40_o));
  ci_74189 inst41 (.SEL(inst11b_out), .D(D1), .RW(RW), .O(inst41_o));
  ci_74189 inst42 (.SEL(inst12b_out), .D(D1), .RW(RW), .O(inst42_o));
  ci_74189 inst43 (.SEL(inst13b_out), .D(D1), .RW(RW), .O(inst43_o));
  ci_74189 inst44 (.SEL(inst14b_out), .D(D1), .RW(RW), .O(inst44_o));
  ci_74189 inst45 (.SEL(inst15b_out), .D(D1), .RW(RW), .O(inst45_o));
  ci_74189 inst30 (.SEL(inst17b_out), .D(D1), .RW(RW), .O(inst30_o));
  or inst165 (inst165_out, inst39_o, inst38_o, inst37_o, inst36_o, inst35_o, inst34_o, inst33_o, inst10_o);
  or inst159 (inst159_out, inst40_o, inst30_o, inst46_o, inst45_o, inst44_o, inst43_o, inst42_o, inst41_o);
  or inst160 (O1, inst159_out, inst165_out);
  ci_74189 inst18 (.SEL(inst7b_out), .D(D0), .RW(RW), .O(inst18_o));
  ci_74189 inst22 (.SEL(inst10b_out), .D(D0), .RW(RW), .O(inst22_o));
  ci_74189 inst23 (.SEL(inst11b_out), .D(D0), .RW(RW), .O(inst23_o));
  ci_74189 inst24 (.SEL(inst12b_out), .D(D0), .RW(RW), .O(inst24_o));
  ci_74189 inst25 (.SEL(inst13b_out), .D(D0), .RW(RW), .O(inst25_o));
  ci_74189 inst26 (.SEL(inst14b_out), .D(D0), .RW(RW), .O(inst26_o));
  ci_74189 inst27 (.SEL(inst15b_out), .D(D0), .RW(RW), .O(inst27_o));
  ci_74189 inst28 (.SEL(inst16b_out), .D(D0), .RW(RW), .O(inst28_o));
  ci_74189 inst12 (.SEL(instb_out), .D(D0), .RW(RW), .O(inst12_o));
  ci_74189 inst13 (.SEL(instbc_out), .D(D0), .RW(RW), .O(inst13_o));
  ci_74189 inst15 (.SEL(inst4b_out), .D(D0), .RW(RW), .O(inst15_o));
  ci_74189 inst16 (.SEL(inst5b_out), .D(D0), .RW(RW), .O(inst16_o));
  ci_74189 inst17 (.SEL(inst6b_out), .D(D0), .RW(RW), .O(inst17_o));
  ci_74189 inst19 (.SEL(inst8b_out), .D(D0), .RW(RW), .O(inst19_o));
  ci_74189 inst20 (.SEL(inst9b_out), .D(D0), .RW(RW), .O(inst20_o));
  ci_74189 inst29 (.SEL(inst17b_out), .D(D0), .RW(RW), .O(inst29_o));
  or inst166 (inst166_out, inst20_o, inst19_o, inst18_o, inst17_o, inst16_o, inst15_o, inst13_o, inst12_o);
  or inst161 (inst161_out, inst22_o, inst29_o, inst28_o, inst27_o, inst26_o, inst25_o, inst24_o, inst23_o);
  or inst162 (O0, inst161_out, inst166_out);
endmodule
